# Altium project PCB Layout Replication - Brendan Cook.PrjPcb (part 2 of 2)

## Sheet  SFP_PortA-B.SchDoc: Small Form Factor Pluggable Plus
size B; DocumentNumber: 14; SheetNumber: 14; SheetTotal: 46
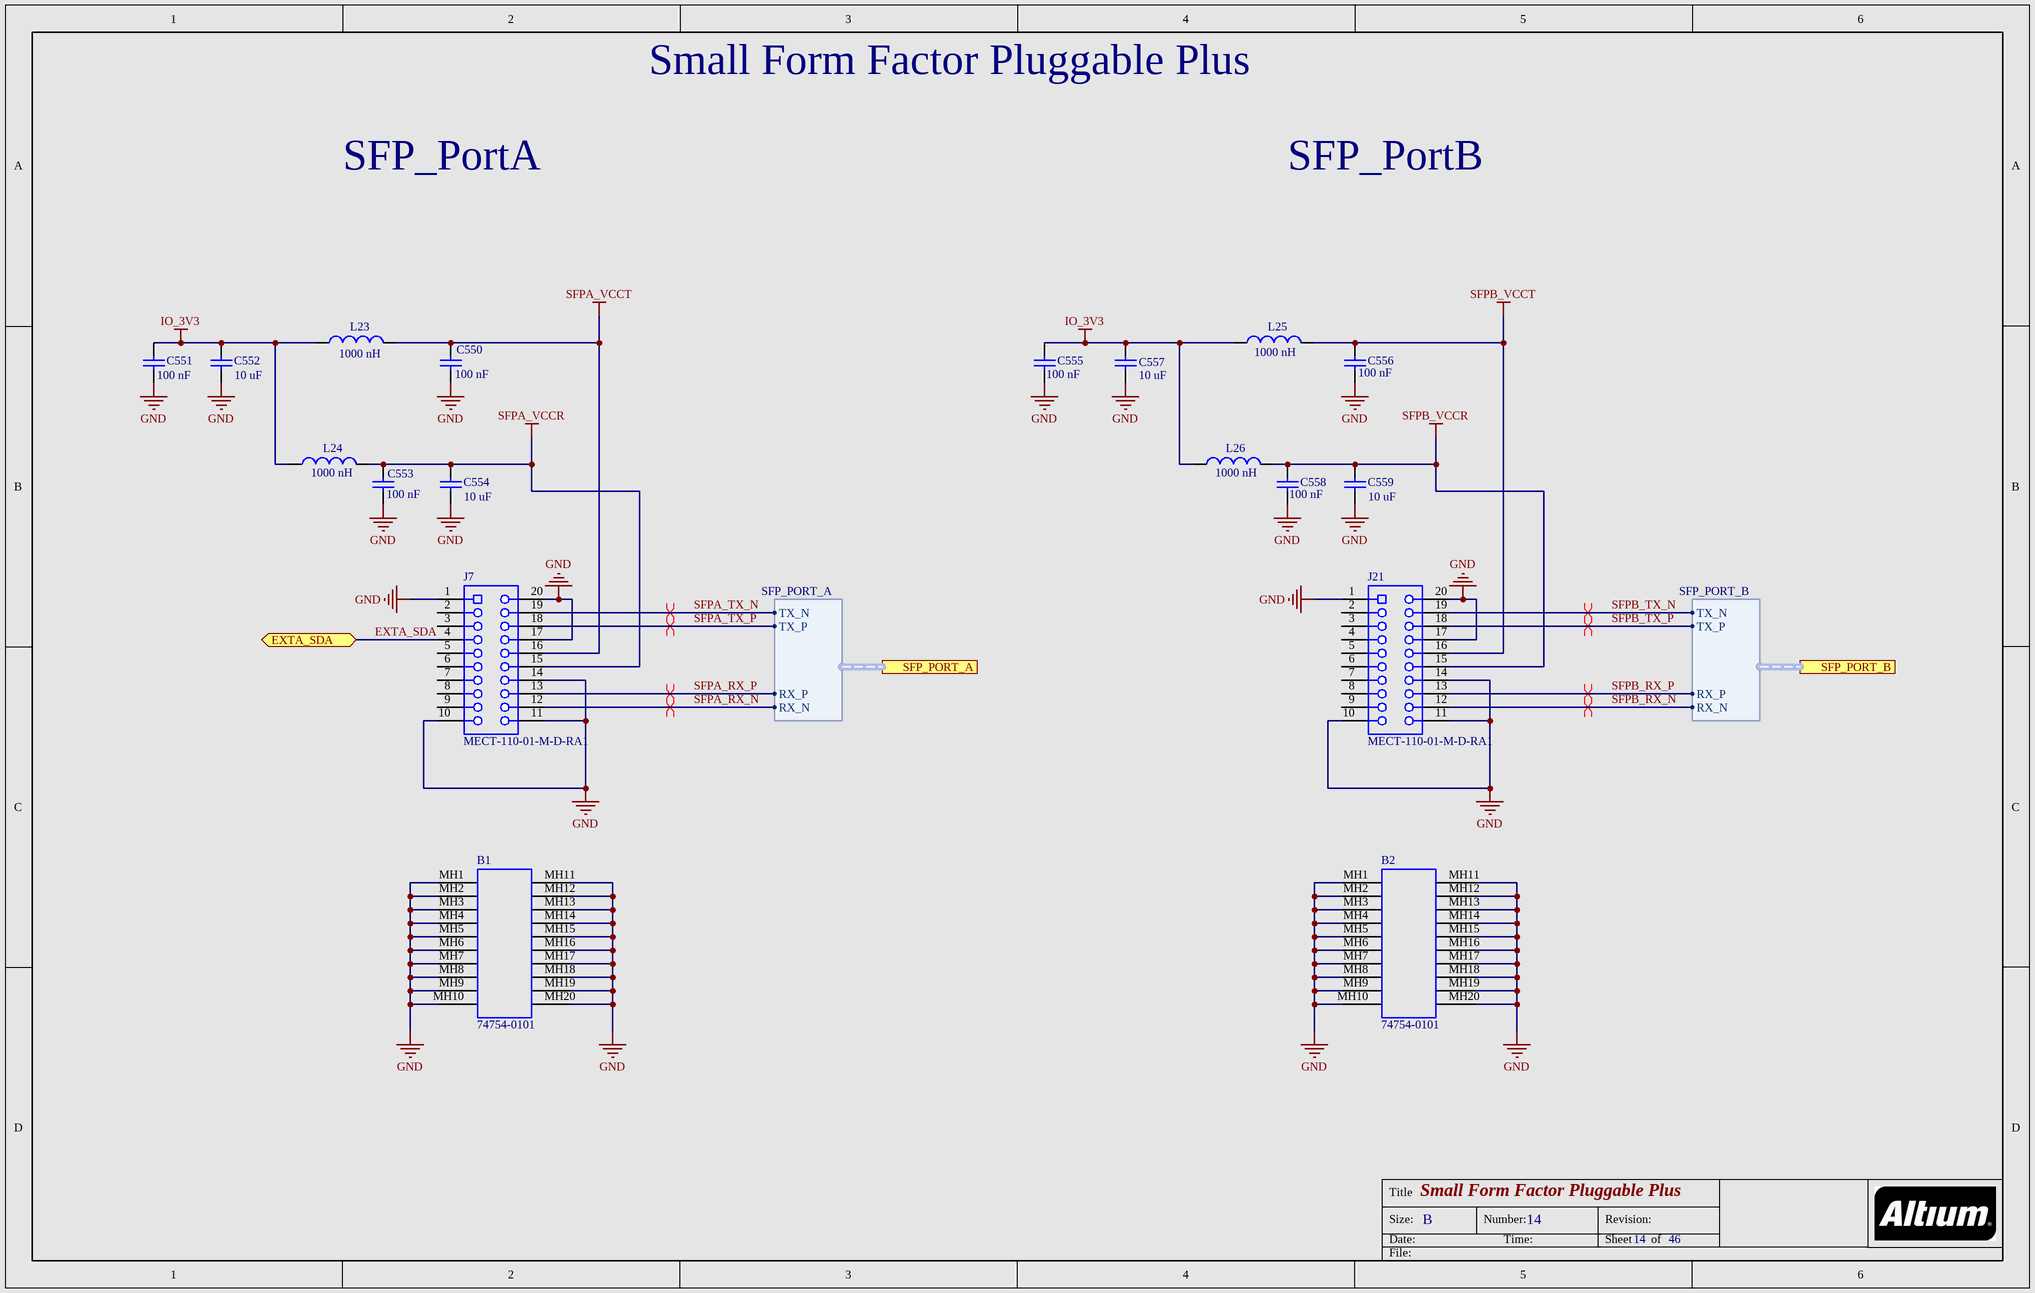
[diagram p2:  SFP_PortA-B.SchDoc]

### Parts
B1  74754-0101  [MOLX-74754-0101_V]
B2  74754-0101  [MOLX-74754-0101_V]
C550  Capacitance: 100 nF  [CAPC1005X55X10LL05]  (hidden comment: C1005X7R1E104M)
C551  Capacitance: 100 nF  [CAPC1005X55X10LL05]  (hidden comment: C1005X7R1E104M)
C552  Capacitance: 10 uF  [CAPC2013X100X20NL20]  (hidden comment: C2012X5R1C106K085AC)
C553  Capacitance: 100 nF  [CAPC1005X55X10LL05]  (hidden comment: C1005X7R1E104M)
C554  Capacitance: 10 uF  [CAPC2013X100X20NL20]  (hidden comment: C2012X5R1C106K085AC)
C555  Capacitance: 100 nF  [CAPC1005X55X10LL05]  (hidden comment: C1005X7R1E104M)
C556  Capacitance: 100 nF  [CAPC1005X55X10LL05]  (hidden comment: C1005X7R1E104M)
C557  Capacitance: 10 uF  [CAPC2013X100X20NL20]  (hidden comment: C2012X5R1C106K085AC)
C558  Capacitance: 100 nF  [CAPC1005X55X10LL05]  (hidden comment: C1005X7R1E104M)
C559  Capacitance: 10 uF  [CAPC2013X100X20NL20]  (hidden comment: C2012X5R1C106K085AC)
J7  MECT-110-01-M-D-RA1  [SMTC-MECT-110-01-M-D-RA1_V]
J21  MECT-110-01-M-D-RA1  [SMTC-MECT-110-01-M-D-RA1_V]
L23  Inductance: 1000 nH  [COIL-1008CS_V]  (hidden comment: 1008CS-102XFLC)
L24  Inductance: 1000 nH  [COIL-1008CS_V]  (hidden comment: 1008CS-102XFLC)
L25  Inductance: 1000 nH  [COIL-1008CS_V]  (hidden comment: 1008CS-102XFLC)
L26  Inductance: 1000 nH  [COIL-1008CS_V]  (hidden comment: 1008CS-102XFLC)

### Ports
EXTA_SDA (bidir), SFP_PORT_A (harness SFP_PORT_A), SFP_PORT_B (harness SFP_PORT_B)

### Harnesses
SFP_PORT_A: TX_P, TX_N, RX_P, RX_N
SFP_PORT_B: TX_P, TX_N, RX_P, RX_N

### Nets
GND: B1.MH1 B1.MH2 B1.MH3 B1.MH4 B1.MH5 B1.MH6 B1.MH7 B1.MH8 B1.MH9 B1.MH10 B1.MH11 B1.MH12 B1.MH13 B1.MH14 B1.MH15 B1.MH16 B1.MH17 B1.MH18 B1.MH19 B1.MH20 B2.MH1 B2.MH2 B2.MH3 B2.MH4 B2.MH5 B2.MH6 B2.MH7 B2.MH8 B2.MH9 B2.MH10 B2.MH11 B2.MH12 B2.MH13 B2.MH14 B2.MH15 B2.MH16 B2.MH17 B2.MH18 B2.MH19 B2.MH20 C550.1 C551.1 C552.1 C553.1 C554.1 C555.1 C556.1 C557.1 C558.1 C559.1 J7.1 J7.10 J7.11 J7.14 J7.17 J7.20 J21.1 J21.10 J21.11 J21.14 J21.17 J21.20
IO_3V3: C551.2 C552.2 C555.2 C557.2 L23.1 L24.1 L25.1 L26.1
SFPA_VCCR: C553.2 C554.2 J7.15 L24.2
SFPA_VCCT: C550.2 J7.16 L23.2
SFPB_VCCR: C558.2 C559.2 J21.15 L26.2
SFPB_VCCT: C556.2 J21.16 L25.2
EXTA_SDA: J7.4 ; port EXTA_SDA
SFPA_RX_N: J7.12 ; port SFP_PORT_A.RX_N
SFPA_RX_P: J7.13 ; port SFP_PORT_A.RX_P
SFPA_TX_N: J7.19 ; port SFP_PORT_A.TX_N
SFPA_TX_P: J7.18 ; port SFP_PORT_A.TX_P
SFPB_RX_N: J21.12 ; port SFP_PORT_B.RX_N
SFPB_RX_P: J21.13 ; port SFP_PORT_B.RX_P
SFPB_TX_N: J21.19 ; port SFP_PORT_B.TX_N
SFPB_TX_P: J21.18 ; port SFP_PORT_B.TX_P

Not connected (* = marked no-connect by the designer): J7 2 3 5 6 7 8 9; J21 2 3 4 5 6 7 8 9

### Layout directives
differential pair: SFPA_RX_N, SFPA_RX_P, SFPA_TX_N, SFPA_TX_P, SFPB_RX_N, SFPB_RX_P, SFPB_TX_N, SFPB_TX_P

### Notes on the sheet
- SFP_PortA
- SFP_PortB
- Title
- Size:
- Date:
- B
- Number:
- Time:
- Revision:
- Sheet
- of
- File:

### Library data of the parts
B1 B2 = CMP-1704-00003-1: SFP+ Cage, Single Port, Height 10.85 mm, Tail Height 3.05 mm, -40 to 85 degC, RoHS, Tray; Manufacturer: Molex; ComponentLink1URL: http://www.molex.com/; PartNumber: 74754-0101; Mounting Technology: Through Hole; PackageDescription: SFP+ Cage, Single Port, Height 10.85 mm, Tail Height 3.05 mm; ComponentLink2Description: Datasheet; DatasheetVersion: Rev. Jul-15; PackageVersion: Rev. J, 02/2015; ComponentLink1Description: Manufacturer URL; ComponentLink2URL: http://www.molex.com/webdocs/datasheets/pdf/en-us/0747540101_IO_CONNECTORS.pdf; ComponentLink3Description: Package Specification; PackageReference: 74754-0101; ComponentLink3URL: http://www.molex.com/pdm_docs/sd/747540101_sd.pdf
C550 C551 C553 C555 C556 C558 = CMP-1663-00009-2: Chip Capacitor, 0.1 uF, +/- 20%, 25 V, -55 to 125 degC, 0402 (1005 Metric), RoHS, Tape and Reel; Type (Capacitors): X7R; Voltage Rating: 25 V; Case\/Package: 0402; Tolerance: 20%; Max Operating Temperature: 125 degC; ComponentLink2URL: http://www.farnell.com/datasheets/1571323.pdf; ComponentLink1URL: http://www.tdk.com/; RoHSCompliant: true; Packaging: Tape and Reel; Mounting Technology: Surface Mount; ComponentLink2Description: Datasheet; Case Code (Imperial): 0402; DatasheetVersion: 09/2011; ComponentLink1Description: Manufacturer URL; PackageDescription: 2-Pin Surface Mount Device, Body 1 x 0.5 mm; PackageReference: 0402; Min Operating Temperature: -55 degC; Case Code (Metric): 1005; Height: 0.5 mm; Package Quantity: 10000; Width: 0.5 mm; Pins: 2; Voltage Rating (DC): 25 V; PartNumber: C1005X7R1E104M; Mount: Surface Mount; Length: 1 mm
C552 C554 C557 C559 = CMP-1663-00007-1: Chip Capacitor, 10 uF, +/- 10%, 16 V, -55 to 85 degC, 0805 (2012 Metric), RoHS, Tape and Reel; Type (Capacitors): X5R; Voltage Rating (DC): 16 V; Case\/Package: 0805; Tolerance: 10%; Mounting Technology: Surface Mount; Min Operating Temperature: -55 degC; Length: 2 mm; Case Code (Metric): 2012; PackageReference: 0805; Voltage Rating: 16 V; RoHSCompliant: true; ComponentLink1Description: Manufacturer URL; Width: 1.25 mm; ComponentLink1URL: http://www.tdk.com/; Max Operating Temperature: 85 degC; REACH SVHC: No SVHC; Mount: Surface Mount; ComponentLink2URL: https://product.tdk.com/info/en/catalog/datasheets/mlcc_commercial_general_en.pdf; ComponentLink2Description: Datasheet; Pins: 2; Packaging: Tape and Reel; Height: 0.85 mm; Package Quantity: 1; DatasheetVersion: 03/2015; Case Code (Imperial): 0805; PackageDescription: 2-Pin Surface Mount Device, Body 2 x 1.25 mm
J7 J21 = CMP-1707-00001-1: Female Transceiver Interface, Pitch 0.8 mm, 2 x 10 Position, Height 5.2 mm, -55 to 125 degC, RoHS, Tube; Manufacturer: Samtec; ComponentLink1URL: http://www.samtec.com/; ComponentLink2Description: Datasheet; ComponentLink2URL: http://suddendocs.samtec.com/catalog_english/mect.pdf; PartNumber: MECT-110-01-M-D-RA1; PackageDescription: Female Transceiver Interface, Pitch 0.8 mm, 2 x 10 Position, Height 5.2 mm; Mounting Technology: Surface Mount; ComponentLink3Description: Package Specification; ComponentLink1Description: Manufacturer URL; DatasheetVersion: Rev. Feb-16; PackageReference: MECT-110-01-M-D-RA1; PackageVersion: Rev. H, 06/2016; ComponentLink3URL: http://suddendocs.samtec.com/prints/mect-1xx-xx-xx-xx-d-rax-xx-footprint.pdf
L23-L26 = CMP-1716-00001-2: Chip Inductor, 1000 nH, +/- 1%, -40 to 125 degC, 2-Pin SMD, RoHS, Tape and Reel; DatasheetVersion: 01/2012; ComponentLink2URL: http://datasheet.octopart.com/1008CS-102XFLC-Coilcraft-datasheet-10791557.pdf; ComponentLink1Description: Manufacturer URL; PartNumber: 1008CS-102XFLC; ComponentLink1URL: http://www.coilcraft.com/; PackageDescription: 2-Pin Surface Mount Device, Body 2.92 x 2.79 mm; RoHSCompliant: False; ComponentLink2Description: Datasheet; Mounting Technology: Surface Mount

## Sheet  MiniPC_Func.SchDoc: MiniPC Block Diagram
size D; DocumentNumber: 1; SheetNumber: 1; SheetTotal: 46
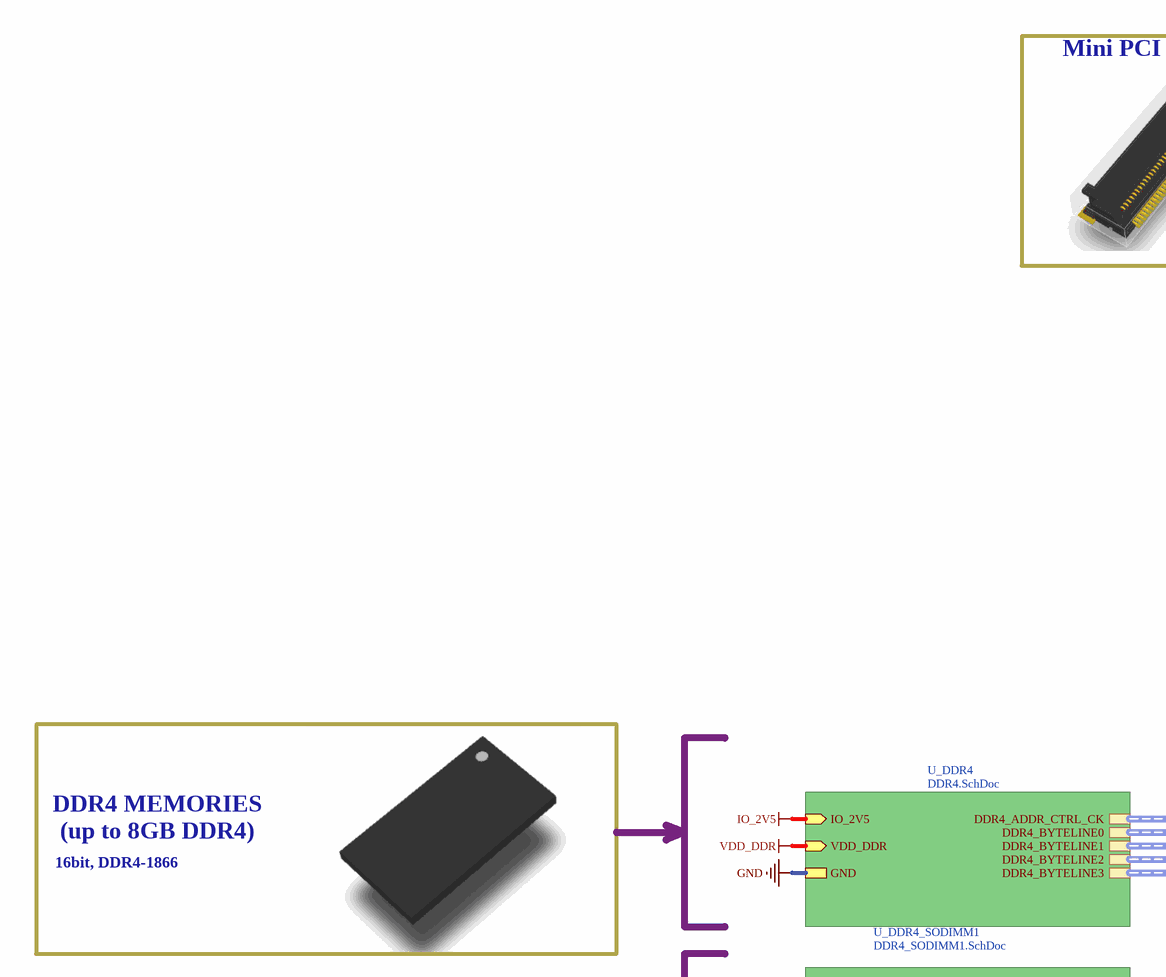
[diagram p3:  MiniPC_Func.SchDoc, top left]
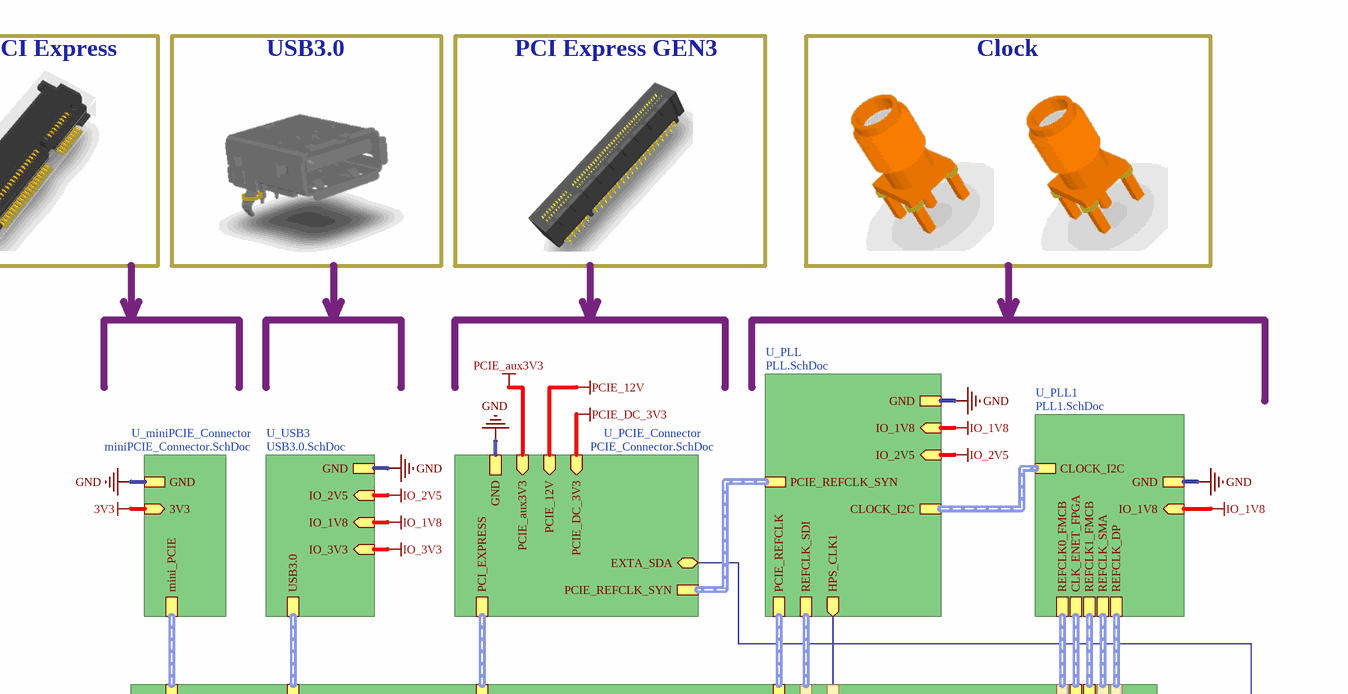
[diagram p4:  MiniPC_Func.SchDoc, top middle]
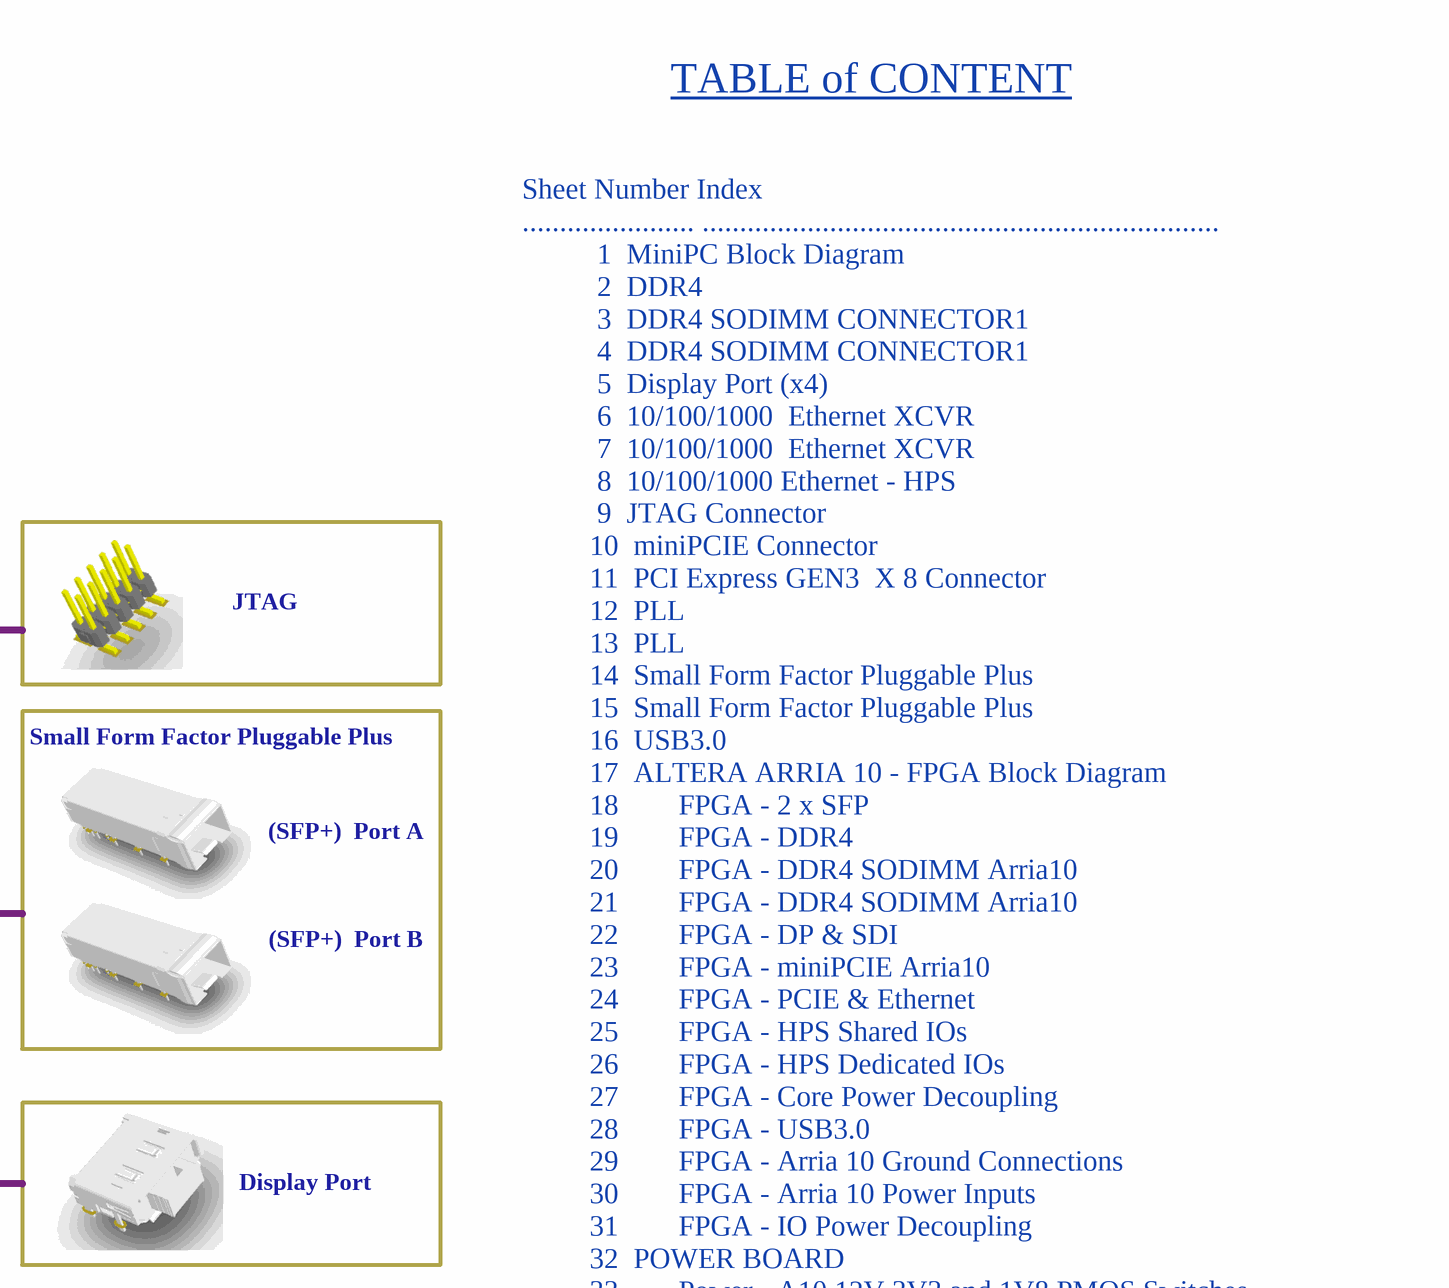
[diagram p5:  MiniPC_Func.SchDoc, top right]
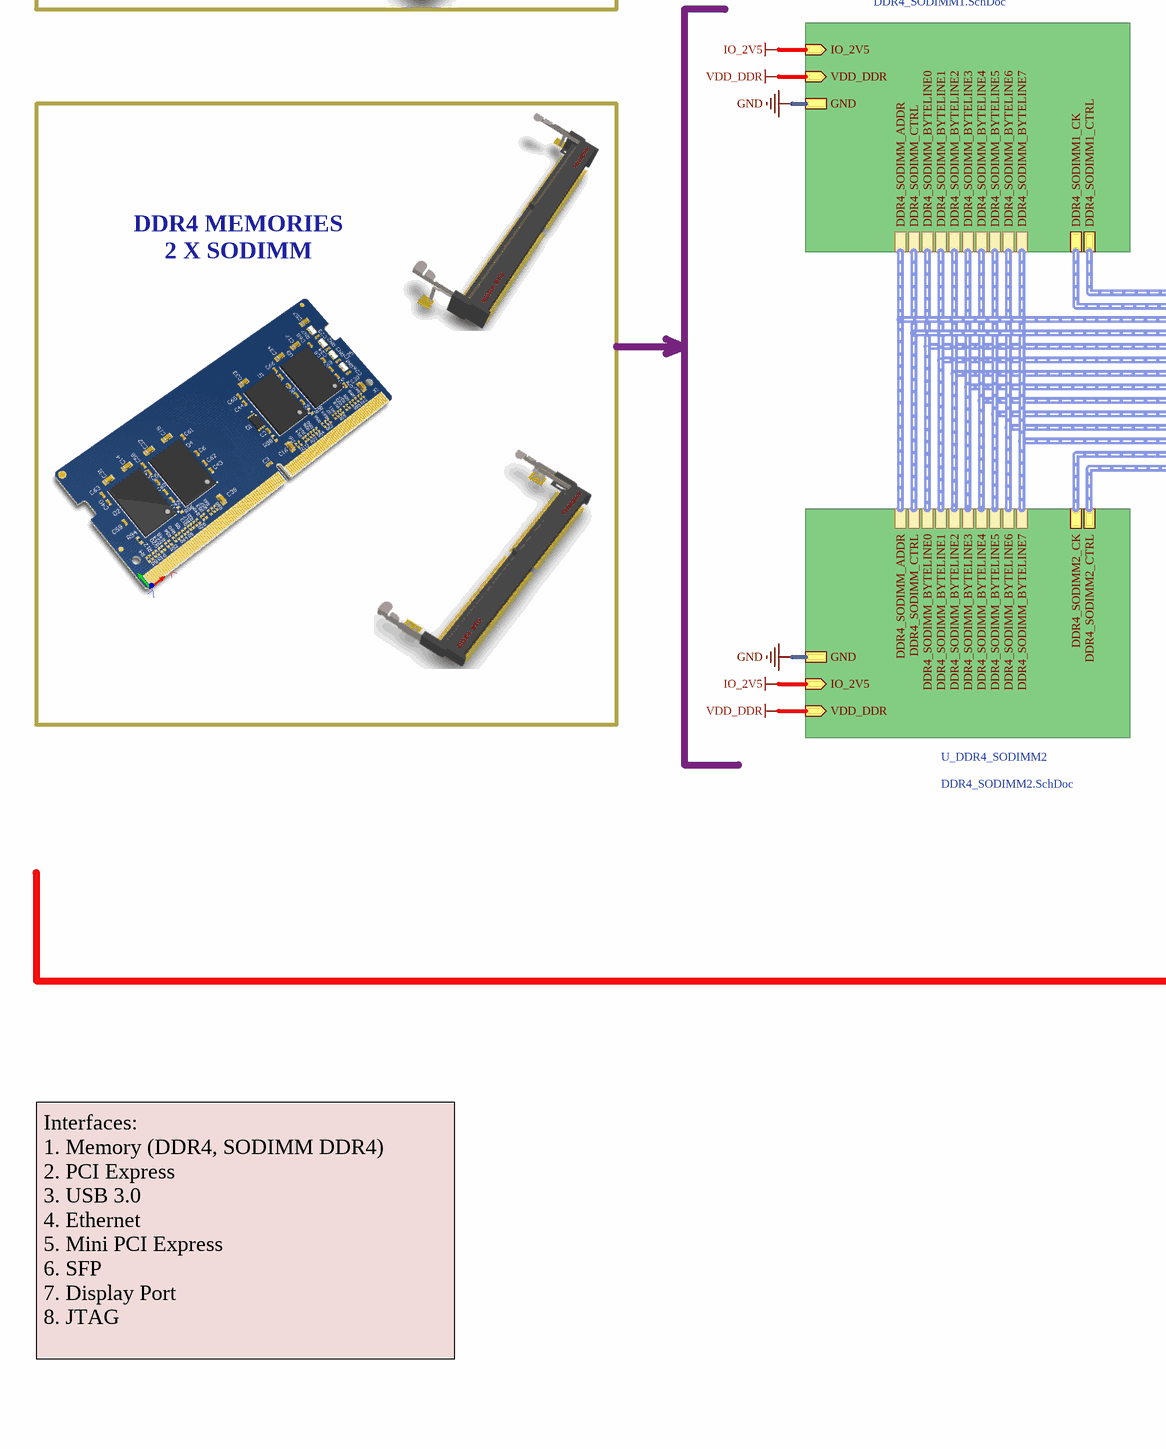
[diagram p6:  MiniPC_Func.SchDoc, bottom left]
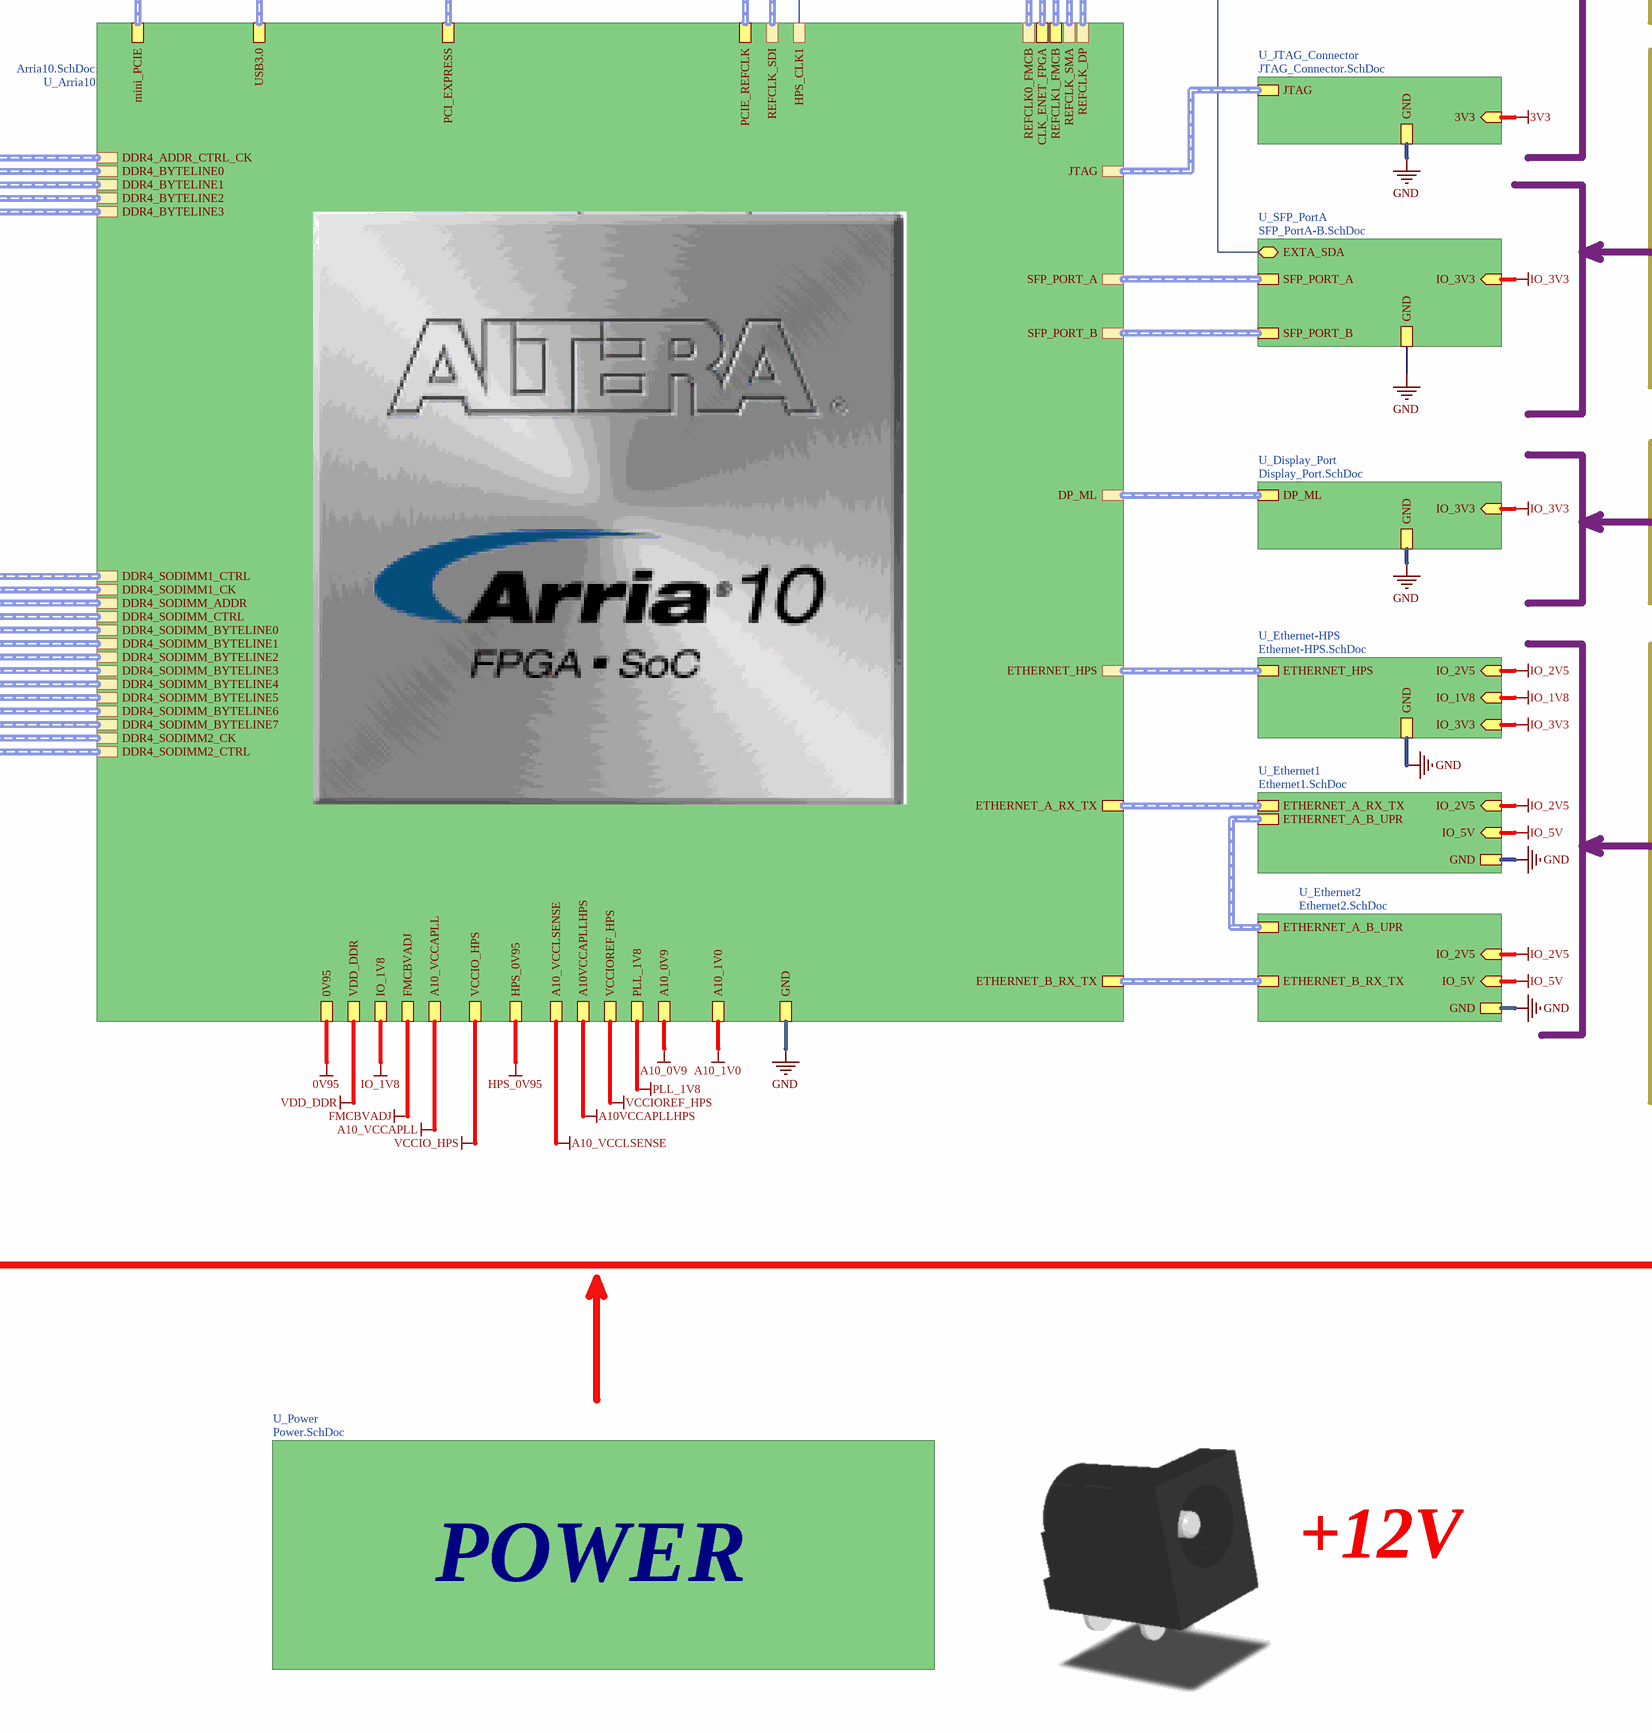
[diagram p7:  MiniPC_Func.SchDoc, bottom middle]
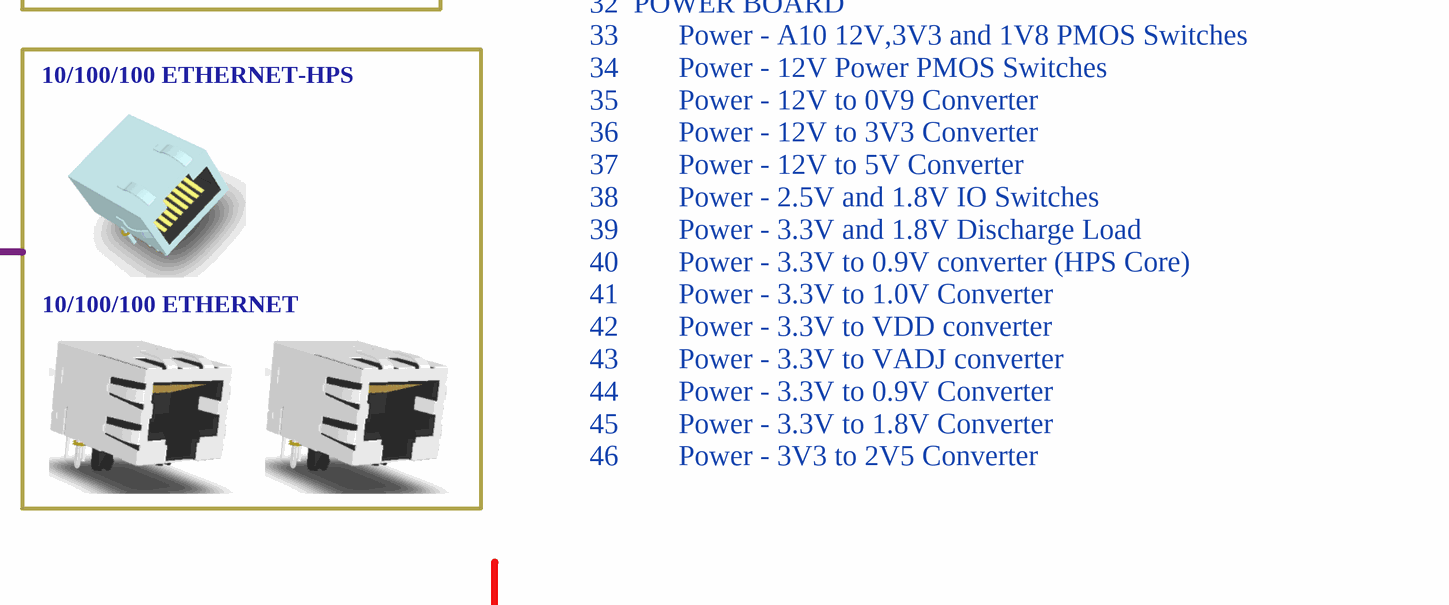
[diagram p8:  MiniPC_Func.SchDoc, bottom right]

### Sub-sheets
U_Arria10 = Arria10.SchDoc (file not in this document): IO_1V8, VDD_DDR, FMCBVADJ, A10_VCCAPLL, HPS_0V95, VCCIO_HPS, VCCIOREF_HPS, A10VCCAPLLHPS, A10_VCCLSENSE, 0V95, PLL_1V8, A10_1V0, A10_0V9, DDR4_ADDR_CTRL_CK, DDR4_BYTELINE0, DDR4_BYTELINE1, DDR4_BYTELINE2, DDR4_BYTELINE3, DDR4_SODIMM_ADDR, DDR4_SODIMM1_CK, DDR4_SODIMM2_CK, DDR4_SODIMM_BYTELINE0, DDR4_SODIMM_BYTELINE1, DDR4_SODIMM_BYTELINE2, DDR4_SODIMM_BYTELINE3, DDR4_SODIMM_BYTELINE4, DDR4_SODIMM_BYTELINE5, DDR4_SODIMM_BYTELINE6, DDR4_SODIMM_BYTELINE7, DDR4_SODIMM_CTRL, DDR4_SODIMM1_CTRL, DDR4_SODIMM2_CTRL, mini_PCIE, JTAG, SFP_PORT_A, SFP_PORT_B, REFCLK0_FMCB, REFCLK_SMA, REFCLK_DP, REFCLK_SDI, DP_ML, ETHERNET_HPS, HPS_CLK1, USB3.0, ETHERNET_A_RX_TX, ETHERNET_B_RX_TX, PCI_EXPRESS, CLK_ENET_FPGA, PCIE_REFCLK, REFCLK1_FMCB, GND
U_DDR4 = DDR4.SchDoc (file not in this document): DDR4_ADDR_CTRL_CK (harness DDR4_ADDR_CTRL_CK), DDR4_BYTELINE0 (harness DDR4_BYTELINE0), DDR4_BYTELINE1 (harness DDR4_BYTELINE1), DDR4_BYTELINE2 (harness DDR4_BYTELINE2), DDR4_BYTELINE3 (harness DDR4_BYTELINE3), IO_2V5 (in), VDD_DDR (in), GND
U_DDR4_SODIMM1 = DDR4_SODIMM1.SchDoc (file not in this document): DDR4_SODIMM1_CTRL (harness DDR4_SODIMM1_CTRL), DDR4_SODIMM_BYTELINE0 (harness DDR4_SODIMM_BYTELINE0), DDR4_SODIMM_BYTELINE1 (harness DDR4_SODIMM_BYTELINE1), DDR4_SODIMM_BYTELINE2 (harness DDR4_SODIMM_BYTELINE2), DDR4_SODIMM_BYTELINE3 (harness DDR4_SODIMM_BYTELINE3), DDR4_SODIMM_BYTELINE4 (harness DDR4_SODIMM_BYTELINE4), DDR4_SODIMM_BYTELINE5 (harness DDR4_SODIMM_BYTELINE5), DDR4_SODIMM_BYTELINE6 (harness DDR4_SODIMM_BYTELINE6), DDR4_SODIMM_BYTELINE7 (harness DDR4_SODIMM_BYTELINE7), DDR4_SODIMM_ADDR (harness DDR4_SODIMM_ADDR), DDR4_SODIMM_CTRL (harness DDR4_SODIMM_CTRL), DDR4_SODIMM1_CK (harness DDR4_SODIMM1_CK), IO_2V5 (in), VDD_DDR (in), GND
U_DDR4_SODIMM2 = DDR4_SODIMM2.SchDoc (file not in this document): DDR4_SODIMM_ADDR (harness DDR4_SODIMM_ADDR), DDR4_SODIMM_CTRL (harness DDR4_SODIMM_CTRL), DDR4_SODIMM_BYTELINE0 (harness DDR4_SODIMM_BYTELINE0), DDR4_SODIMM_BYTELINE1 (harness DDR4_SODIMM_BYTELINE1), DDR4_SODIMM_BYTELINE2 (harness DDR4_SODIMM_BYTELINE2), DDR4_SODIMM_BYTELINE3 (harness DDR4_SODIMM_BYTELINE3), DDR4_SODIMM_BYTELINE4 (harness DDR4_SODIMM_BYTELINE4), DDR4_SODIMM_BYTELINE5 (harness DDR4_SODIMM_BYTELINE5), DDR4_SODIMM_BYTELINE6 (harness DDR4_SODIMM_BYTELINE6), DDR4_SODIMM_BYTELINE7 (harness DDR4_SODIMM_BYTELINE7), DDR4_SODIMM2_CTRL (harness DDR4_SODIMM2_CTRL), DDR4_SODIMM2_CK (harness DDR4_SODIMM2_CK), IO_2V5 (in), VDD_DDR (in), GND
U_Display_Port = Display_Port.SchDoc (file not in this document): DP_ML (harness DP_ML), IO_3V3 (in), GND
U_Ethernet1 = Ethernet1.SchDoc (file not in this document): ETHERNET_A_RX_TX (harness ETHERNET_A_RX_TX), ETHERNET_A_B_UPR (harness ETHERNET_A_B_UPR), IO_2V5 (in), IO_5V (in), GND
U_Ethernet2 = Ethernet2.SchDoc (file not in this document): ETHERNET_A_B_UPR (harness ETHERNET_A_B_UPR), ETHERNET_B_RX_TX (harness ETHERNET_B_RX_TX), IO_2V5 (in), IO_5V (in), GND
U_Ethernet-HPS = Ethernet-HPS.SchDoc (file not in this document): ETHERNET_HPS (harness ETHERNET_HPS), IO_1V8 (in), IO_2V5 (in), IO_3V3 (in), GND
U_JTAG_Connector = JTAG_Connector.SchDoc (file not in this document): JTAG (harness JTAG), 3V3 (in), GND
U_miniPCIE_Connector = miniPCIE_Connector.SchDoc (file not in this document): mini_PCIE (harness mini_PCIE), 3V3 (in), GND
U_PCIE_Connector = PCIE_Connector.SchDoc (file not in this document): EXTA_SDA (bidir), PCI_EXPRESS (harness PCI_EXPRESS), PCIE_REFCLK_SYN (harness PCIE_REFCLK_SYN), PCIE_DC_3V3 (in), PCIE_12V (in), PCIE_aux3V3 (in), GND
U_PLL = PLL.SchDoc (file not in this document): PCIE_REFCLK (harness REFCLK), PCIE_REFCLK_SYN (harness PCIE_REFCLK_SYN), REFCLK_SDI (harness REFCLK_SDI), HPS_CLK1 (out), CLOCK_I2C (harness CLOCK_I2C), IO_2V5 (in), IO_1V8 (in), GND
U_PLL1 = PLL1.SchDoc (file not in this document): REFCLK0_FMCB (harness REFCLK0_FMCB), CLK_ENET_FPGA (harness CLK_ENET), REFCLK1_FMCB (harness REFCLK1_FMCB), REFCLK_SMA (harness REFCLK_SMA), REFCLK_DP (harness REFCLK_DP), CLOCK_I2C (harness CLOCK_I2C), IO_1V8 (in), GND
U_Power = Power.SchDoc (file not in this document): no entries
U_SFP_PortA = SFP_PortA-B.SchDoc (file not in this document): EXTA_SDA (bidir), SFP_PORT_A (harness SFP_PORT_A), IO_3V3 (in), GND, SFP_PORT_B (harness SFP_PORT_B)
U_USB3 = USB3.0.SchDoc (file not in this document): USB3.0 (harness USB3.0), IO_1V8 (in), IO_2V5 (in), IO_3V3 (in), GND

### Nets
0V95: sheet U_Arria10/0V95
3V3: sheet U_JTAG_Connector/3V3, sheet U_miniPCIE_Connector/3V3
A10_0V9: sheet U_Arria10/A10_0V9
A10_1V0: sheet U_Arria10/A10_1V0
A10_VCCAPLL: sheet U_Arria10/A10_VCCAPLL
A10_VCCLSENSE: sheet U_Arria10/A10_VCCLSENSE
A10VCCAPLLHPS: sheet U_Arria10/A10VCCAPLLHPS
FMCBVADJ: sheet U_Arria10/FMCBVADJ
GND: sheet U_Arria10/GND, sheet U_DDR4/GND, sheet U_DDR4_SODIMM1/GND, sheet U_DDR4_SODIMM2/GND, sheet U_Ethernet-HPS/GND, sheet U_SFP_PortA/GND, sheet U_JTAG_Connector/GND, sheet U_Display_Port/GND, sheet U_Ethernet1/GND, sheet U_Ethernet2/GND, sheet U_miniPCIE_Connector/GND, sheet U_USB3/GND, sheet U_PCIE_Connector/GND, sheet U_PLL1/GND, sheet U_PLL/GND
HPS_0V95: sheet U_Arria10/HPS_0V95
IO_1V8: sheet U_Arria10/IO_1V8, sheet U_Ethernet-HPS/IO_1V8, sheet U_USB3/IO_1V8, sheet U_PLL1/IO_1V8, sheet U_PLL/IO_1V8
IO_2V5: sheet U_DDR4/IO_2V5, sheet U_DDR4_SODIMM1/IO_2V5, sheet U_DDR4_SODIMM2/IO_2V5, sheet U_Ethernet-HPS/IO_2V5, sheet U_Ethernet1/IO_2V5, sheet U_Ethernet2/IO_2V5, sheet U_USB3/IO_2V5, sheet U_PLL/IO_2V5
IO_3V3: sheet U_Ethernet-HPS/IO_3V3, sheet U_SFP_PortA/IO_3V3, sheet U_Display_Port/IO_3V3, sheet U_USB3/IO_3V3
IO_5V: sheet U_Ethernet1/IO_5V, sheet U_Ethernet2/IO_5V
PCIE_12V: sheet U_PCIE_Connector/PCIE_12V
PCIE_aux3V3: sheet U_PCIE_Connector/PCIE_aux3V3
PCIE_DC_3V3: sheet U_PCIE_Connector/PCIE_DC_3V3
PLL_1V8: sheet U_Arria10/PLL_1V8
VCCIO_HPS: sheet U_Arria10/VCCIO_HPS
VCCIOREF_HPS: sheet U_Arria10/VCCIOREF_HPS
VDD_DDR: sheet U_Arria10/VDD_DDR, sheet U_DDR4/VDD_DDR, sheet U_DDR4_SODIMM1/VDD_DDR, sheet U_DDR4_SODIMM2/VDD_DDR
(unnamed): sheet U_Arria10/HPS_CLK1, sheet U_PLL/HPS_CLK1
(unnamed): sheet U_SFP_PortA/EXTA_SDA, sheet U_PCIE_Connector/EXTA_SDA

### Buses and harness runs
harness sheet U_Arria10/CLK_ENET_FPGA = sheet U_PLL1/CLK_ENET_FPGA
harness sheet U_Arria10/DDR4_ADDR_CTRL_CK = sheet U_DDR4/DDR4_ADDR_CTRL_CK
harness sheet U_Arria10/DDR4_BYTELINE0 = sheet U_DDR4/DDR4_BYTELINE0
harness sheet U_Arria10/DDR4_BYTELINE1 = sheet U_DDR4/DDR4_BYTELINE1
harness sheet U_Arria10/DDR4_BYTELINE2 = sheet U_DDR4/DDR4_BYTELINE2
harness sheet U_Arria10/DDR4_BYTELINE3 = sheet U_DDR4/DDR4_BYTELINE3
harness sheet U_Arria10/DDR4_SODIMM1_CK = sheet U_DDR4_SODIMM1/DDR4_SODIMM1_CK
harness sheet U_Arria10/DDR4_SODIMM1_CTRL = sheet U_DDR4_SODIMM1/DDR4_SODIMM1_CTRL
harness sheet U_Arria10/DDR4_SODIMM2_CK = sheet U_DDR4_SODIMM2/DDR4_SODIMM2_CK
harness sheet U_Arria10/DDR4_SODIMM2_CTRL = sheet U_DDR4_SODIMM2/DDR4_SODIMM2_CTRL
harness sheet U_Arria10/DDR4_SODIMM_ADDR = sheet U_DDR4_SODIMM1/DDR4_SODIMM_ADDR = sheet U_DDR4_SODIMM2/DDR4_SODIMM_ADDR
harness sheet U_Arria10/DDR4_SODIMM_BYTELINE0 = sheet U_DDR4_SODIMM1/DDR4_SODIMM_BYTELINE0 = sheet U_DDR4_SODIMM2/DDR4_SODIMM_BYTELINE0
harness sheet U_Arria10/DDR4_SODIMM_BYTELINE1 = sheet U_DDR4_SODIMM1/DDR4_SODIMM_BYTELINE1 = sheet U_DDR4_SODIMM2/DDR4_SODIMM_BYTELINE1
harness sheet U_Arria10/DDR4_SODIMM_BYTELINE2 = sheet U_DDR4_SODIMM1/DDR4_SODIMM_BYTELINE2 = sheet U_DDR4_SODIMM2/DDR4_SODIMM_BYTELINE2
harness sheet U_Arria10/DDR4_SODIMM_BYTELINE3 = sheet U_DDR4_SODIMM1/DDR4_SODIMM_BYTELINE3 = sheet U_DDR4_SODIMM2/DDR4_SODIMM_BYTELINE3
harness sheet U_Arria10/DDR4_SODIMM_BYTELINE4 = sheet U_DDR4_SODIMM1/DDR4_SODIMM_BYTELINE4 = sheet U_DDR4_SODIMM2/DDR4_SODIMM_BYTELINE4
harness sheet U_Arria10/DDR4_SODIMM_BYTELINE5 = sheet U_DDR4_SODIMM1/DDR4_SODIMM_BYTELINE5 = sheet U_DDR4_SODIMM2/DDR4_SODIMM_BYTELINE5
harness sheet U_Arria10/DDR4_SODIMM_BYTELINE6 = sheet U_DDR4_SODIMM1/DDR4_SODIMM_BYTELINE6 = sheet U_DDR4_SODIMM2/DDR4_SODIMM_BYTELINE6
harness sheet U_Arria10/DDR4_SODIMM_BYTELINE7 = sheet U_DDR4_SODIMM1/DDR4_SODIMM_BYTELINE7 = sheet U_DDR4_SODIMM2/DDR4_SODIMM_BYTELINE7
harness sheet U_Arria10/DDR4_SODIMM_CTRL = sheet U_DDR4_SODIMM1/DDR4_SODIMM_CTRL = sheet U_DDR4_SODIMM2/DDR4_SODIMM_CTRL
harness sheet U_Arria10/DP_ML = sheet U_Display_Port/DP_ML
harness sheet U_Arria10/ETHERNET_A_RX_TX = sheet U_Ethernet1/ETHERNET_A_RX_TX
harness sheet U_Arria10/ETHERNET_B_RX_TX = sheet U_Ethernet2/ETHERNET_B_RX_TX
harness sheet U_Arria10/ETHERNET_HPS = sheet U_Ethernet-HPS/ETHERNET_HPS
harness sheet U_Arria10/JTAG = sheet U_JTAG_Connector/JTAG
harness sheet U_Arria10/mini_PCIE = sheet U_miniPCIE_Connector/mini_PCIE
harness sheet U_Arria10/PCI_EXPRESS = sheet U_PCIE_Connector/PCI_EXPRESS
harness sheet U_Arria10/PCIE_REFCLK = sheet U_PLL/PCIE_REFCLK
harness sheet U_Arria10/REFCLK0_FMCB = sheet U_PLL1/REFCLK0_FMCB
harness sheet U_Arria10/REFCLK1_FMCB = sheet U_PLL1/REFCLK1_FMCB
harness sheet U_Arria10/REFCLK_DP = sheet U_PLL1/REFCLK_DP
harness sheet U_Arria10/REFCLK_SDI = sheet U_PLL/REFCLK_SDI
harness sheet U_Arria10/REFCLK_SMA = sheet U_PLL1/REFCLK_SMA
harness sheet U_Arria10/SFP_PORT_A = sheet U_SFP_PortA/SFP_PORT_A
harness sheet U_Arria10/SFP_PORT_B = sheet U_SFP_PortA/SFP_PORT_B
harness sheet U_Arria10/USB3.0 = sheet U_USB3/USB3.0
harness sheet U_Ethernet1/ETHERNET_A_B_UPR = sheet U_Ethernet2/ETHERNET_A_B_UPR
harness sheet U_PCIE_Connector/PCIE_REFCLK_SYN = sheet U_PLL/PCIE_REFCLK_SYN
harness sheet U_PLL1/CLOCK_I2C = sheet U_PLL/CLOCK_I2C

### Notes on the sheet
- Mini PCI Express
- USB3.0
- PCI Express GEN3
- Clock
- TABLE of CONTENT
- JTAG
- Small Form Factor Pluggable Plus
- DDR4 MEMORIES
- 16bit, DDR4-1866
- (up to 8GB DDR4)
- (SFP+)  Port A
- (SFP+)  Port B
- 2 X SODIMM
- Display Port
- 10/100/100 ETHERNET-HPS
- 10/100/100 ETHERNET
- Sheet Number	Index
  .......................	.....................................................................
  1		MiniPC Block Diagram
  2		DDR4
  3		DDR4 SODIMM CONNECTOR1
  4		DDR4 SODIMM CONNECTOR1
  5		Display Port (x4)
  6		10/100/1000  Ethernet XCVR
  7		10/100/1000  Ethernet XCVR
  8		10/100/1000 Ethernet - HPS
  9		JTAG Connector
  10		miniPCIE Connector
  11		PCI Express GEN3  X 8 Connector
  12		PLL
  13		PLL
  14		Small Form Factor Pluggable Plus
  15		Small Form Factor Pluggable Plus
  16		USB3.0
  17		ALTERA ARRIA 10 - FPGA Block Diagram
  18		      FPGA - 2 x SFP
  19		      FPGA - DDR4
  20		      FPGA - DDR4 SODIMM Arria10
  21		      FPGA - DDR4 SODIMM Arria10
  22		      FPGA - DP & SDI
  23		      FPGA - miniPCIE Arria10
  24		      FPGA - PCIE & Ethernet
  25		      FPGA - HPS Shared IOs
  26		      FPGA - HPS Dedicated IOs
  27		      FPGA - Core Power Decoupling
  28		      FPGA - USB3.0
  29		      FPGA - Arria 10 Ground Connections
  30		      FPGA - Arria 10 Power Inputs
  31		      FPGA - IO Power Decoupling
  32		POWER BOARD
  33		      Power - A10 12V,3V3 and 1V8 PMOS Switches
  34		      Power - 12V Power PMOS Switches
  35		      Power - 12V to 0V9 Converter
  36		      Power - 12V to 3V3 Converter
  37		      Power - 12V to 5V Converter
  38		      Power - 2.5V and 1.8V IO Switches
  39		      Power - 3.3V and 1.8V Discharge Load
  40		      Power - 3.3V to 0.9V converter (HPS Core)
  41		      Power - 3.3V to 1.0V Converter
  42		      Power - 3.3V to VDD converter
  43		      Power - 3.3V to VADJ converter
  44		      Power - 3.3V to 0.9V Converter
  45		      Power - 3.3V to 1.8V Converter
  46		      Power - 3V3 to 2V5 Converter
- +12V
- Interfaces:
  1. Memory (DDR4, SODIMM DDR4)
  2. PCI Express
  3. USB 3.0
  4. Ethernet
  5. Mini PCI Express
  6. SFP
  7. Display Port
  8. JTAG
- POWER
- Title
- Size:
- Date:
- File:
- B
- Number:
- Time:
- Revision:
- Sheet
- of

## Nets that join several sheets
GND:  Ethernet1 (39 pins),  Ethernet2 (39 pins),  SFP_PortA-B (62 pins)
IO_2V5:  Ethernet1 (40 pins),  Ethernet2 (40 pins)
IO_5V:  Ethernet1 (C327.2 U19.1),  Ethernet2 (C353.2 U22.1)